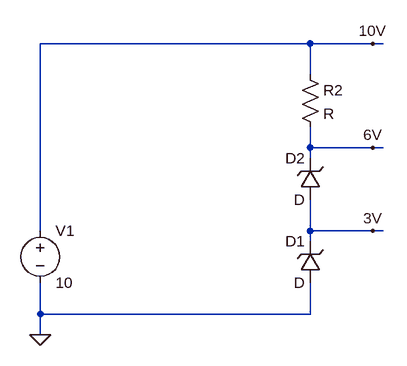
[diagram p0: schematic Test5 - Zener.asc]
Test5 - Zener.asc, the LTspice schematic file:
Version 4
SHEET 1 880 680
WIRE 608 -192 192 -192
WIRE 704 -192 608 -192
WIRE 720 -192 704 -192
WIRE 608 -144 608 -192
WIRE 608 -32 608 -64
WIRE 704 -32 608 -32
WIRE 720 -32 704 -32
WIRE 608 -16 608 -32
WIRE 192 96 192 -192
WIRE 608 96 608 48
WIRE 704 96 608 96
WIRE 720 96 704 96
WIRE 608 112 608 96
WIRE 192 224 192 176
WIRE 608 224 608 176
WIRE 608 224 192 224
WIRE 192 256 192 224
FLAG 192 256 0
FLAG 704 96 3V
FLAG 704 -32 6V
FLAG 704 -192 10V
SYMBOL voltage 192 80 R0
WINDOW 123 0 0 Left 0
WINDOW 39 0 0 Left 0
SYMATTR InstName V1
SYMATTR Value 10
SYMBOL zener 624 176 R180
WINDOW 0 24 64 Left 2
WINDOW 3 24 0 Left 2
SYMATTR InstName D1
SYMBOL zener 624 48 R180
WINDOW 0 24 64 Left 2
WINDOW 3 24 0 Left 2
SYMATTR InstName D2
SYMBOL res 592 -160 R0
SYMATTR InstName R2

The netlist it stands for:
* Test5 - Zener.asc
V1 10V 0 10
D1 0 3V D
D2 3V 6V D
R2 10V 6V R
.model D D
.lib standard.dio
.backanno
.end